# EAGLE design paw (EAGLE 9.0.0)
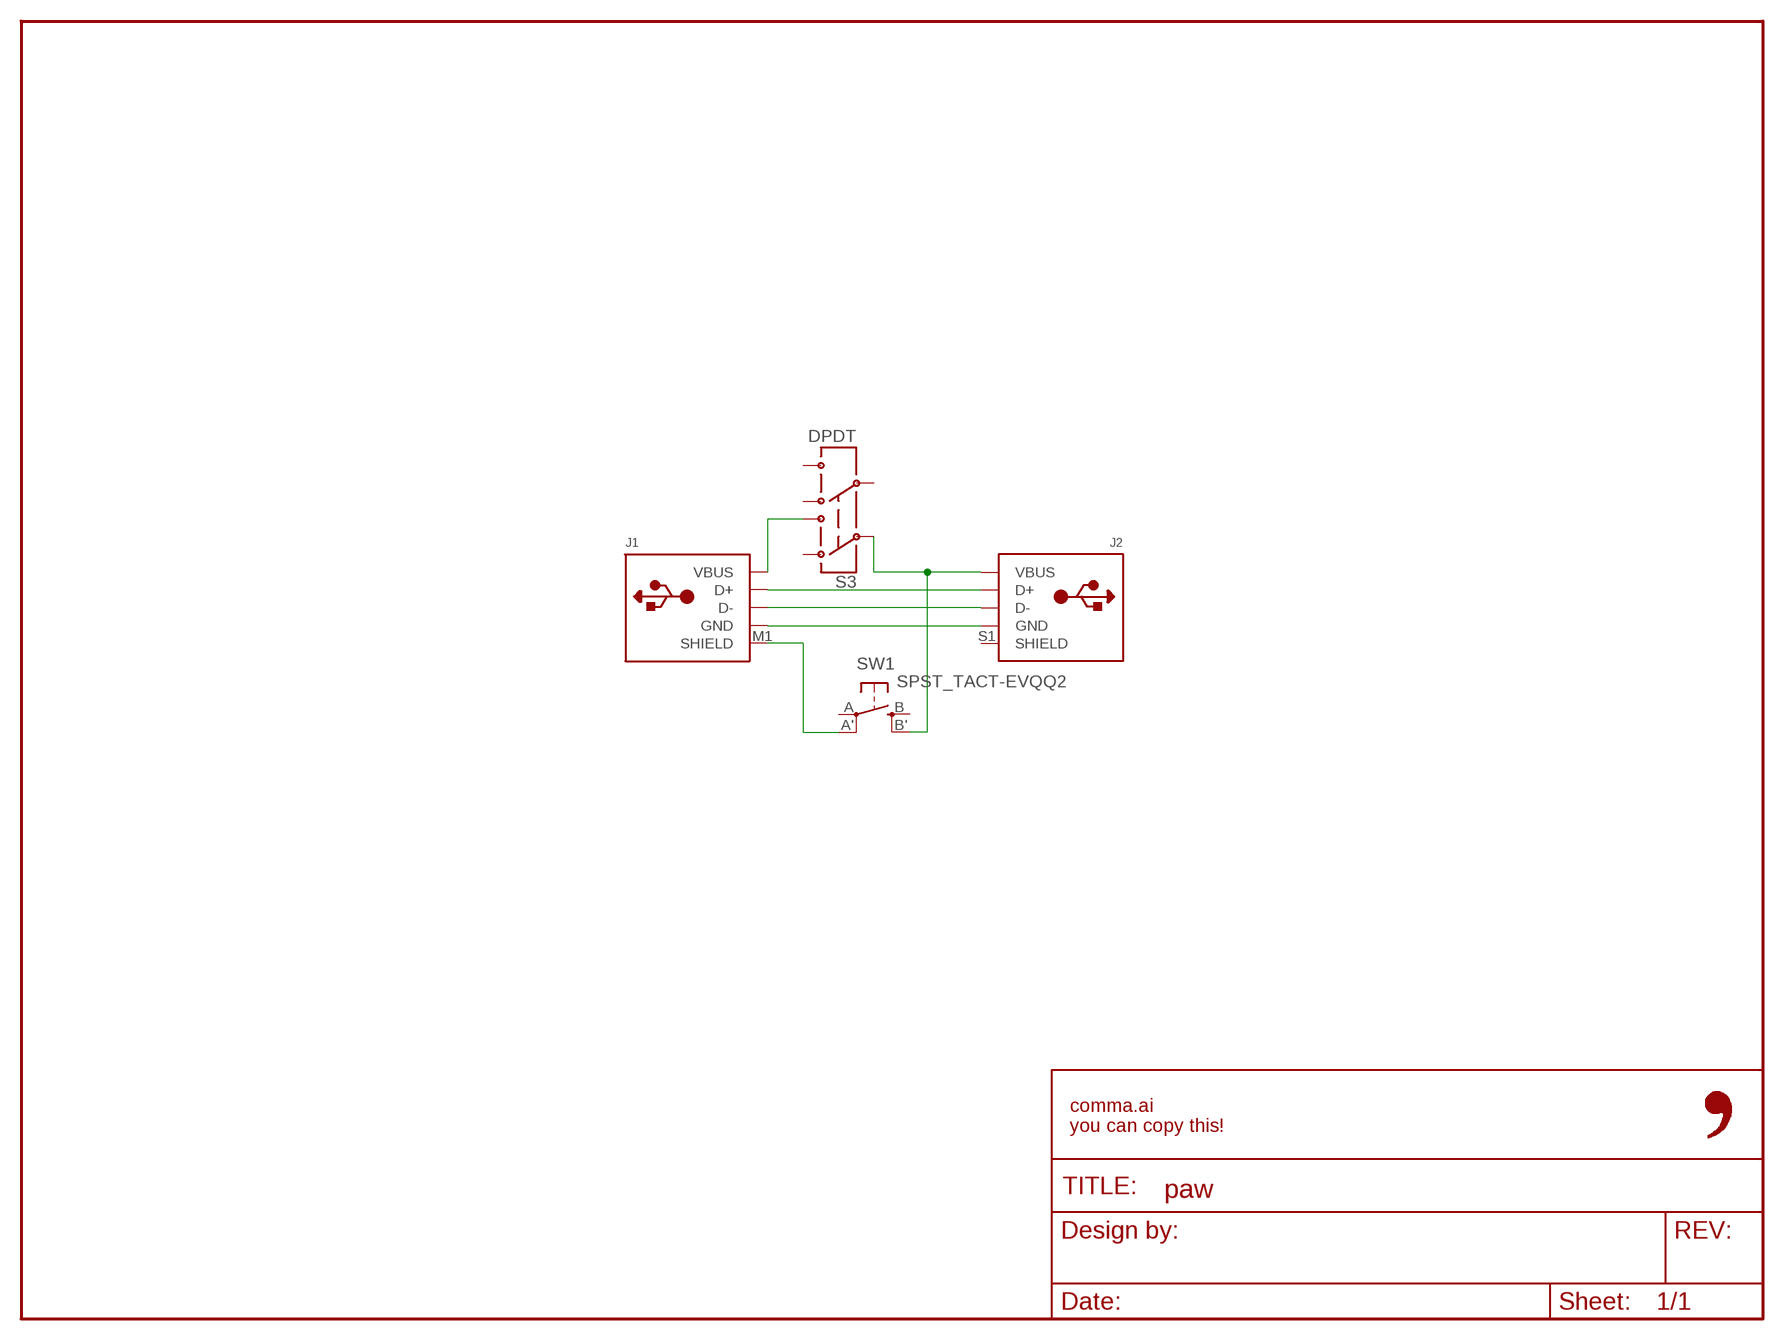
[diagram p0: schematic, sheet 1]

## Parts
FRAME1  FRAME-LETTER-OPENNO_PACKAGE  [DUMMY]
J1  USB-AA-M  [MOLEX_480371000]
J2  USB-MINIBSMD  [USB-MINIB]
S3  DPDT  DPDTDPDT  [AYZ0202]
SW1  SPST_TACT-EVQQ2  [EVQ-Q2]

## Nets
N$1: J1.3(D+) J2.D+
N$2: J1.2(D-) J2.D-
N$3: J1.4(GND) J2.GND
N$4: J1.M1(SHIELD) SW1.A'(P1)
N$5: J1.1(VBUS) S3.3
N$6: J2.VBUS S3.2 SW1.B'(S1)
Unconnected: J2.S1(SHIELD) S3.1 S3.4 S3.5 S3.6 SW1.A(P) SW1.B(S)

## Library data of the parts
FRAME1 = comma.ai:FRAME-LETTER-OPEN: Schematic Frame - Letter Standard 8.5x11 US Letter frame; DESIGNER: Nobody; VERSION: v01
J1 = comma.ai:USB-A
J2 = comma.ai:USB-MINIB
S3 = comma.ai:DPDT
SW1 = adafruit:SPST_TACT: SMT 6mm switch, EVQQ2 series http://www.ladyada.net/library/eagle

## Board
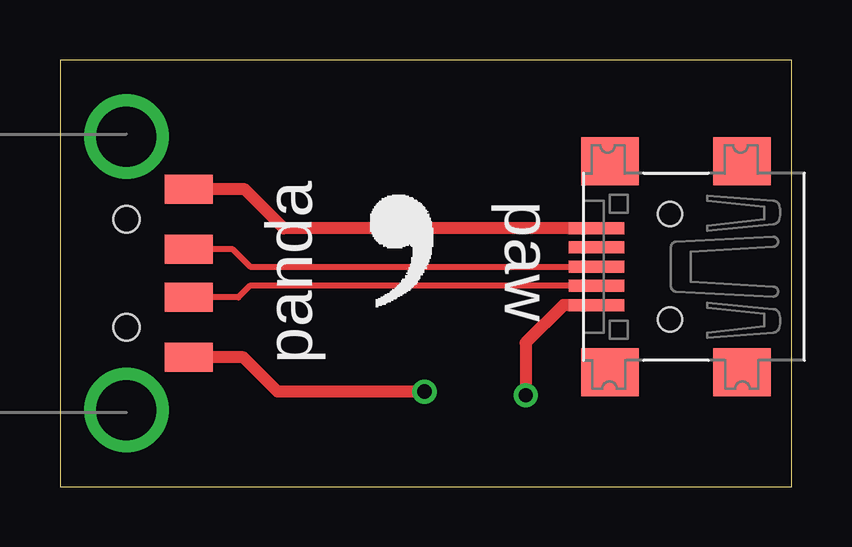
[diagram p1: board, top side]
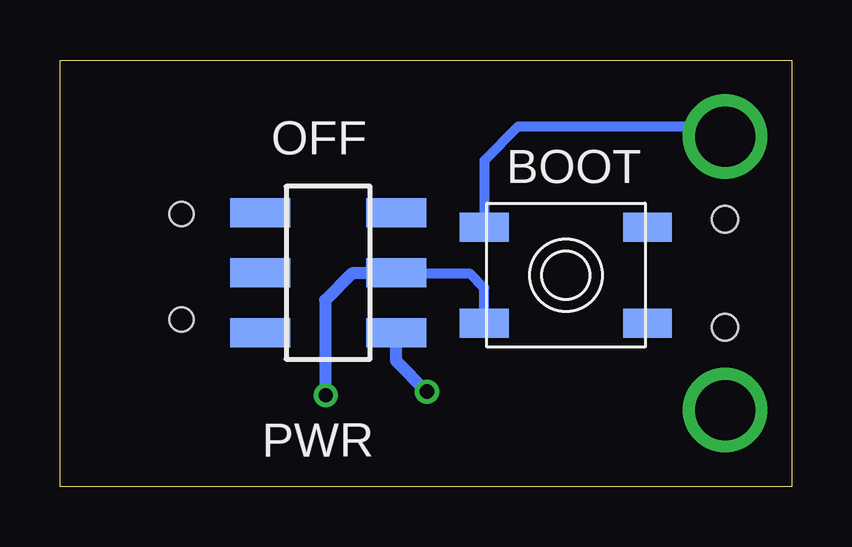
[diagram p2: board, bottom side, seen from below]

Size 30.48 x 17.78 mm. Coordinates in mm from the lower left corner, seen from the top.
Outline: 0,0 30.48,0 30.48,17.78 0,17.78 0,0
Copper layers (1*16): Top 0.035mm / dielectric 1.5mm / Bottom 0.035mm
Design rules "default": minimum track width 10mil, minimum drill 24mil, track to track 8mil, track to pad 8mil, pad to pad 8mil, via to via 8mil, smd to smd 8mil, copper to edge 40mil, drill to drill 8mil, minimum pad ring 10mil, minimum via ring 8mil, stop-mask expansion 4mil, vias tented up to drill 0mil, thermal gap 10mil

### Footprints (pad centres in the part's own frame; a part is rotated, then mirrored left to right if it is on the bottom)
MOLEX_480371000 = smd 1.2 x 2: 1 3.5,2.6; 2 1,2.6; 3 -1,2.6; 4 -3.5,2.6 | drill 2.5: M1 -5.7,0; M2 5.7,0 | hole 1.1: -2.25,0; 2.25,0
USB-MINIB = smd 0.5 x 2.308: D+ 0,4.064; D- -0.8,4.064; GND 1.6,4.064; ID 0.8,4.064; VBUS -1.6,4.064 | smd 2 x 2.4: S1 -4.4,3.5; S2 -4.4,-2; S3 4.4,-2; S4 4.4,3.5 | hole 1: -2.2,1; 2.2,1
AYZ0202 = smd 1.2 x 2.5: 1 -2.5,2.825; 2 0,2.825; 3 2.5,2.825; 4 -2.5,-2.825; 5 0,-2.825; 6 2.5,-2.825
EVQ-Q2 = smd 2.032 x 1.2: A -3.4,-2; A' 3.4,-2; B -3.4,2; B' 3.4,2

### Placement (x,y rotation side)
FRAME1  -13.97,-15.24 0 top  (outside the outline)
J1  2.77,8.89 270 top
J2  26.42,9.17 90 top
S3  19.3,8.92 270 bottom
SW1  9.4,8.81 180 bottom
U$1  [LOGO]  12.27,7.19 0 top

### Tracks (layer width: path | path; a pad name or v marks a point on that pad's centre or on a via)
N$1
  Top 0.254: J2.D+ 7.92,9.17 7.2,9.89 J1.3
N$2
  Top 0.254: J2.D- 7.91,8.37 7.43,7.89 J1.2 5.16,7.87
N$3
  Top 0.508: J2.GND 9.32,10.77 7.7,12.39 J1.4 5.14,12.39
N$4
  Bottom 0.406: J1.M1 3.19,15.01 11.38,15.01 12.8,13.59 SW1.A'
N$5  (via drill 0.6)
  Top 0.508: v15.19,3.96 9.07,3.96 7.64,5.39 J1.1
  Bottom 0.508: v15.19,3.96 16.48,5.25 S3.3
N$6  (via drill 0.6)
  Top 0.508: J2.VBUS 22.63,7.57 20.98,7.57 19.41,5.99 v19.41,3.81
  Bottom 0.406: SW1.B' 12.8,8.28 13.39,8.87 16.43,8.87 S3.2
  Bottom 0.508: S3.2 16.5,8.89 18.31,8.89 19.43,7.77 19.43,3.83 v19.41,3.81

### Text on the board
tNames: paw | panda
bNames: OFF | BOOT | PWR